# Altium schematic sheet eps_pv.SchDoc: Photovoltaics
size A4; DrawnBy: J. Reimer T. Yeung M. Au; Organization: UTAT SS; DocumentNumber: 6; Revision: 2.0; SheetNumber: 6; SheetTotal: 17
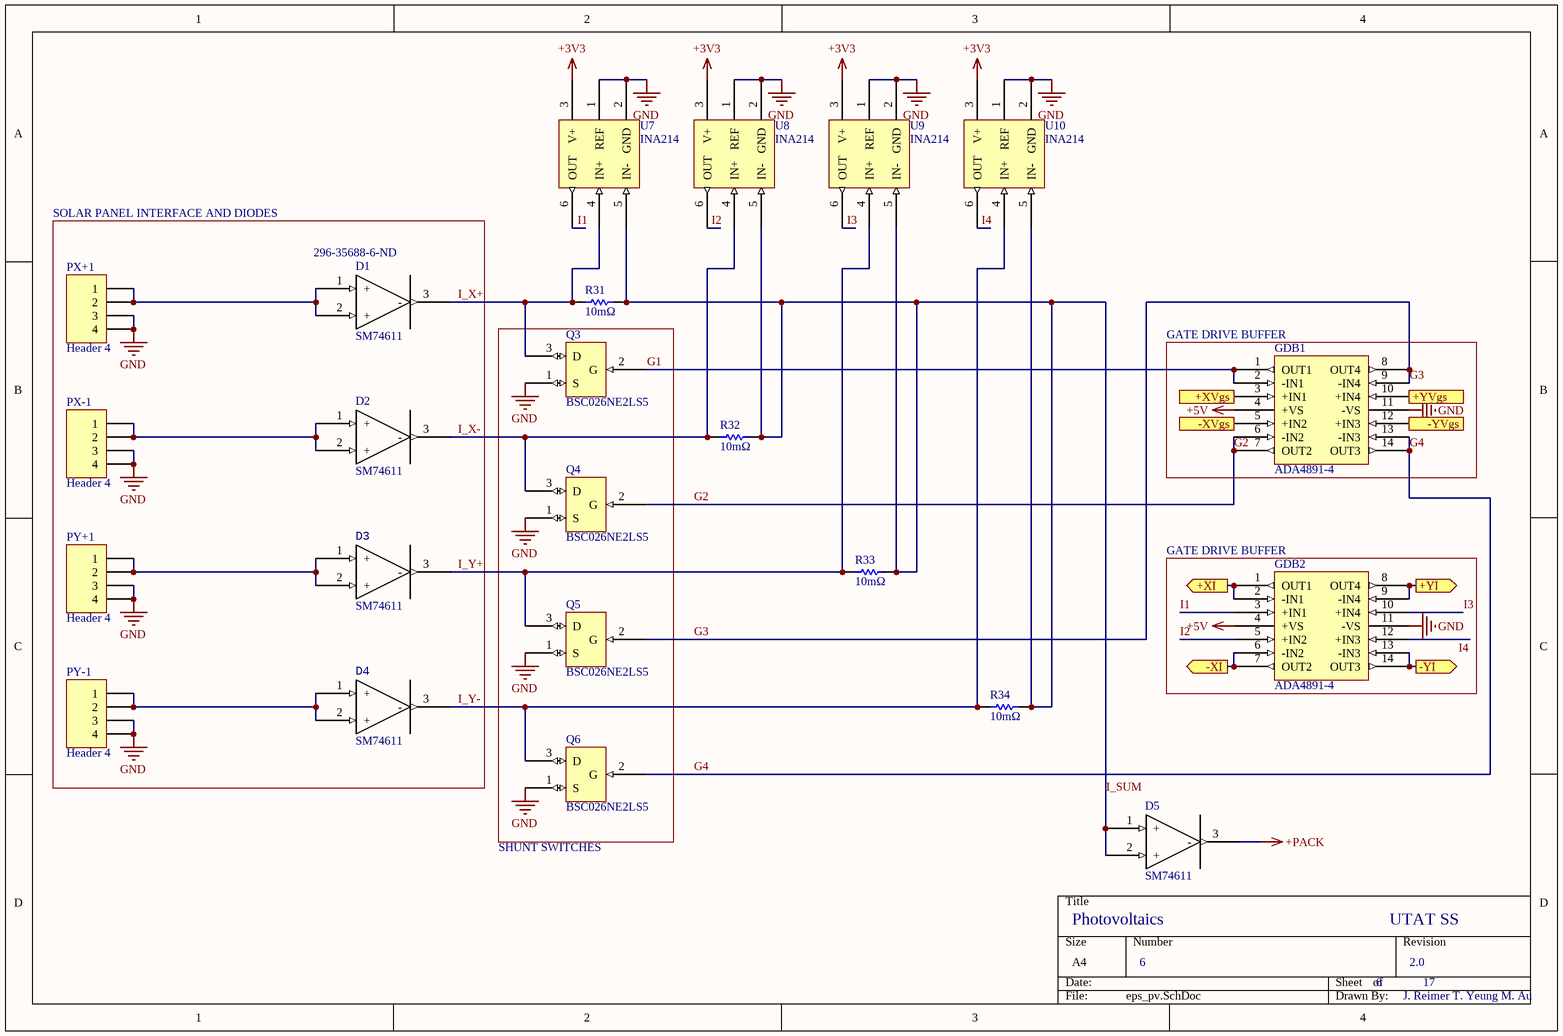
[diagram p0: eps_pv.SchDoc]

## Parts
D1  SM74611  Supplier Part Number 1: 296-35688-6-ND  [TO254P1435X464-3N]
D2  SM74611  [TO254P1435X464-3N]
D3  SM74611  [TO254P1435X464-3N]
D4  SM74611  [TO254P1435X464-3N]
D5  SM74611  [TO254P1435X464-3N]
GDB1  ADA4891-4  [SOIC127P600X175-14N]
GDB2  ADA4891-4  [SOIC127P600X175-14N]
PX+1  Header 4  [WM7622CT-ND]
PX-1  Header 4  [WM7622CT-ND]
PY+1  Header 4  [WM7622CT-ND]
PY-1  Header 4  [WM7622CT-ND]
Q3  BSC026NE2LS5  [INF-PG-TDSON-8-1_V]
Q4  BSC026NE2LS5  [INF-PG-TDSON-8-1_V]
Q5  BSC026NE2LS5  [INF-PG-TDSON-8-1_V]
Q6  BSC026NE2LS5  [INF-PG-TDSON-8-1_V]
R31  10mΩ  [C1206]
R32  10mΩ  [C1206]
R33  10mΩ  [C1206]
R34  10mΩ  [C1206]
U7  INA214  [SOT65P210X110-6N]
U8  INA214  [SOT65P210X110-6N]
U9  INA214  [SOT65P210X110-6N]
U10  INA214  [SOT65P210X110-6N]

## Blocks framed on the sheet
SOLAR PANEL INTERFACE AND DIODES: D1-D4 PX+1 PX-1 PY+1 PY-1
GATE DRIVE BUFFER: GDB1
GATE DRIVE BUFFER: GDB2

## Ports
+XI (out), +XVgs (in), +YI (out), +YVgs (in), -XI (out), -XVgs (in), -YI (out), -YVgs (in)

## Nets
+3V3: U7.3(V+) U8.3(V+) U9.3(V+) U10.3(V+)
+5V: GDB1.4(+VS) GDB2.4(+VS)
+PACK: D5.3(-)
GND: GDB1.11(-VS) GDB2.11(-VS) PX+1.3 PX+1.4 PX-1.3 PX-1.4 PY+1.3 PY+1.4 PY-1.3 PY-1.4 Q3.1(S) Q4.1(S) Q5.1(S) Q6.1(S) U7.1(REF) U7.2(GND) U8.1(REF) U8.2(GND) U9.1(REF) U9.2(GND) U10.1(REF) U10.2(GND)
+XI: GDB2.1(OUT1) GDB2.2(-IN1) ; port +XI
+XVgs: GDB1.3(+IN1) ; port +XVgs
+YI: GDB2.8(OUT4) GDB2.9(-IN4) ; port +YI
+YVgs: GDB1.10(+IN4) ; port +YVgs
-XI: GDB2.6(-IN2) GDB2.7(OUT2) ; port -XI
-XVgs: GDB1.5(+IN2) ; port -XVgs
-YI: GDB2.13(-IN3) GDB2.14(OUT3) ; port -YI
-YVgs: GDB1.12(+IN3) ; port -YVgs
G1: GDB1.1(OUT1) GDB1.2(-IN1) Q3.2(G)
G2: GDB1.6(-IN2) GDB1.7(OUT2) Q4.2(G)
G3: GDB1.8(OUT4) GDB1.9(-IN4) Q5.2(G)
G4: GDB1.13(-IN3) GDB1.14(OUT3) Q6.2(G)
I1: GDB2.3(+IN1) U7.6(OUT)
I2: GDB2.5(+IN2) U8.6(OUT)
I3: GDB2.10(+IN4) U9.6(OUT)
I4: GDB2.12(+IN3) U10.6(OUT)
I_SUM: D5.1(+) D5.2(+) R31.2 R32.2 R33.2 R34.2 U7.5(IN-) U8.5(IN-) U9.5(IN-) U10.5(IN-)
I_X+: D1.3(-) Q3.3(D) R31.1 U7.4(IN+)
I_X-: D2.3(-) Q4.3(D) R32.1 U8.4(IN+)
I_Y+: D3.3(-) Q5.3(D) R33.1 U9.4(IN+)
I_Y-: D4.3(-) Q6.3(D) R34.1 U10.4(IN+)
NetD1_1: D1.1(+) D1.2(+) PX+1.1 PX+1.2
NetD2_1: D2.1(+) D2.2(+) PX-1.1 PX-1.2
NetD3_1: D3.1(+) D3.2(+) PY+1.1 PY+1.2
NetD4_1: D4.1(+) D4.2(+) PY-1.1 PY-1.2

## Notes on the sheet
- SHUNT SWITCHES

## Library data of the parts
D1-D5 = SM74611: PV Diode
  D1: Supplier 1: Digi-Key
GDB1 GDB2 = ADA4891-4: Op-amps; Supplier 1: Digi-Key; Supplier Part Number 1: ADA4891-4ARZ-R7DKR-ND
PX+1 PX-1 PY+1 PY-1 = Header 4: Header, 4-Pin; LatestRevisionDate: 17-Jul-2002; LatestRevisionNote: Re-released for DXP Platform.; Publisher: Altium Limited
  PX+1 PX-1: Supplier 1: Digi-Key; Supplier Part Number 1: WM7622CT-ND
Q3-Q6 = BSC026NE2LS5: MOSFET
  Q3: Supplier 1: Digi-Key; Supplier Part Number 1: BSC026NE2LS5ATMA1DKR-ND
R31-R34 = Res1: Resistor; Published: 8-Jun-2000; LatestRevisionDate: 17-Jul-2002; LatestRevisionNote: Re-released for DXP Platform.; PackageReference: AXIAL-0.3; Publisher: Altium Limited; PackageDescription: Axial Device, Thru-Hole; 2 Leads; 0.3 in Pin Spacing; Value: 10mΩ
  R31: Supplier 1: Digi-Key; Supplier Part Number 1: P0.01BVDKR-ND
U7-U10 = INA214: Current monitor; Supplier 1: Digi-Key; Supplier Part Number 1: 296-38956-6-ND